# Altium schematic sheet ESP32-Cam.SchDoc
size A; SheetNumber: 1; SheetTotal: 2
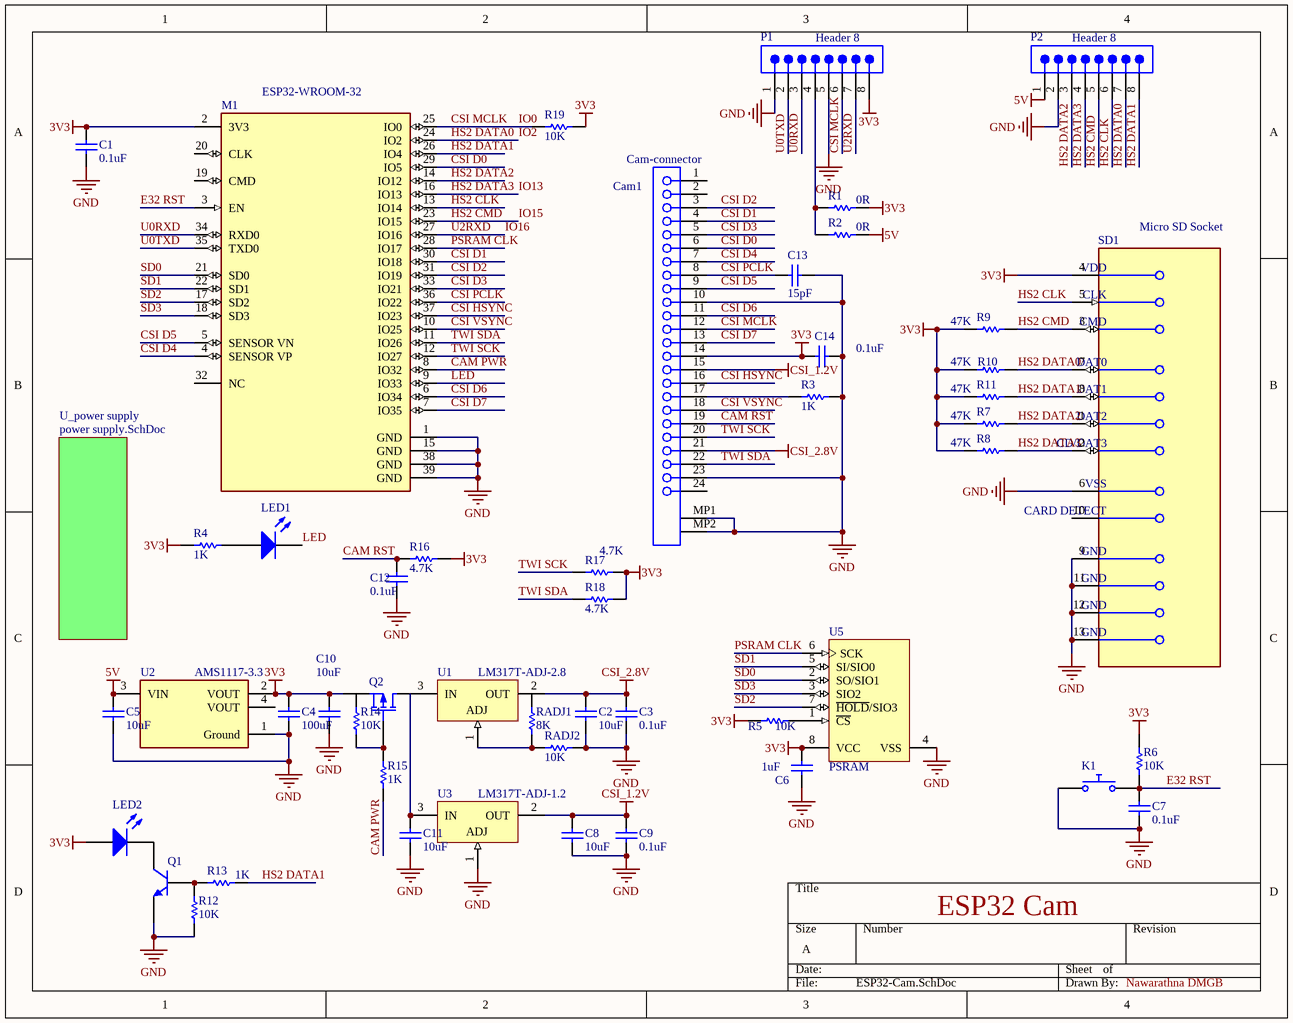
[diagram p0: ESP32-Cam.SchDoc]

## Parts
C1  value 0.1uF  (hidden comment: Capacitor)
C2  value 10uF  (hidden comment: Capacitor)
C3  value 0.1uF  (hidden comment: Capacitor)
C4  value 100uF  (hidden comment: Capacitor)
C5  value 10uF  (hidden comment: Capacitor)
C6  value 1uF  (hidden comment: Capacitor)
C7  value 0.1uF  (hidden comment: Capacitor)
C8  value 10uF  (hidden comment: Capacitor)
C9  value 0.1uF  (hidden comment: Capacitor)
C10  value 10uF  (hidden comment: Capacitor)
C11  value 10uF  (hidden comment: Capacitor)
C12  value 0.1uF  (hidden comment: Capacitor)
C13  value 15pF  (hidden comment: Capacitor)
C14  value 0.1uF  (hidden comment: Capacitor)
Cam1  Cam-connector  [MOLX-52435-2471]
K1  Push Button Normally Opened  (value not drawn)
LED1  Light-Emitting Diode  (value not drawn)
LED2  Light-Emitting Diode  (value not drawn)
M1  ESP32-WROOM-32  [FP-ESP32-WROOM-32-MFG]
P1  Header 8  [66200811122]
P2  Header 8  [66200811122]
Q1  Bipolar NPN 3 Pins Transistor Gummel-Poon Model  (value not drawn)
Q2  P-channel Power MOSFET VDMOS Model  (value not drawn)
R1  value 0R  (hidden comment: Resistor)
R2  value 0R  (hidden comment: Resistor)
R3  value 1K  (hidden comment: Resistor)
R4  value 1K  (hidden comment: Resistor)
R5  value 10K  (hidden comment: Resistor)
R6  value 10K  (hidden comment: Resistor)
R7  value 47K  (hidden comment: Resistor)
R8  value 47K  (hidden comment: Resistor)
R9  value 47K  (hidden comment: Resistor)
R10  value 47K  (hidden comment: Resistor)
R11  value 47K  (hidden comment: Resistor)
R12  value 10K  (hidden comment: Resistor)
R13  value 1K  (hidden comment: Resistor)
R14  value 10K  (hidden comment: Resistor)
R15  value 1K  (hidden comment: Resistor)
R16  value 4.7K  (hidden comment: Resistor)
R17  value 4.7K  (hidden comment: Resistor)
R18  value 4.7K  (hidden comment: Resistor)
R19  value 10K  (hidden comment: Resistor)
RADJ1  value 8K  (hidden comment: Resistor)
RADJ2  value 10K  (hidden comment: Resistor)
SD1  Micro SD Socket  [FP-DM3CS-SF-MFG]
U1  LM317T-ADJ-2.8  [TO-220]
U2  AMS1117-3.3  [FP-AMS1117-IPC_C]
U3  LM317T-ADJ-1.2  [TO-220]
U5  PSRAM  [MCHP-SOIC-SN8_N]

## Sub-sheets
U_power supply = power supply.SchDoc: no entries

## Nets
3V3: C1.1 C4.1 C6.1 C10.1 C14.1 Cam1.14 LED2.1(A) M1.2(3V3) P1.8 Q2.3(S) R1.1 R4.1 R5.1 R6.1 R7.1 R8.1 R9.1 R10.1 R11.1 R16.2 R17.2 R18.2 R19.2 SD1.4(VDD) U2.2(VOUT) U5.8(VCC)
5V: C5.1 P2.1 R2.1 U2.3(VIN)
CSI_1.2V: C8.1 C9.1 Cam1.15 U3.2(OUT)
CSI_2.8V: C2.1 C3.1 Cam1.21 U1.2(OUT)
GND: C1.2 C2.2 C3.2 C4.2 C5.2 C6.2 C7.2 C8.2 C9.2 C10.2 C11.2 C12.2 C13.2 C14.2 Cam1.10 Cam1.23 Cam1.MP1 Cam1.MP2 K1.1 M1.1(GND) M1.15(GND) M1.38(GND) M1.39(GND) P1.1 P1.5 P2.2 Q1.3(E) R3.2 R12.2 RADJ2.2 SD1.6(VSS) SD1.9(GND) SD1.11(GND) SD1.12(GND) SD1.13(GND) U2.1(Ground) U3.1(ADJ) U5.4(VSS)
CAM PWR: M1.8(IO32) R15.2
CAM RST: C12.1 Cam1.19 R16.1
CSI D0: Cam1.6 M1.29(IO5)
CSI D1: Cam1.4 M1.30(IO18)
CSI D2: Cam1.3 M1.31(IO19)
CSI D3: Cam1.5 M1.33(IO21)
CSI D4: Cam1.7 M1.4(SENSOR_VP)
CSI D5: Cam1.9 M1.5(SENSOR_VN)
CSI D6: Cam1.11 M1.6(IO34)
CSI D7: Cam1.13 M1.7(IO35)
CSI HSYNC: Cam1.16 M1.37(IO23)
CSI MCLK: Cam1.12 M1.25(IO0) P1.6 R19.1  [also labelled IO0]
CSI PCLK: C13.1 Cam1.8 M1.36(IO22)
CSI VSYNC: Cam1.18 M1.10(IO25)
E32 RST: C7.1 K1.2 M1.3(EN) R6.2
HS2 CLK: M1.13(IO14) P2.6 SD1.5(CLK)
HS2 CMD: M1.23(IO15) P2.5 R9.2 SD1.3(CMD)  [also labelled IO15]
HS2 DATA0: M1.24(IO2) P2.7 R10.2 SD1.7(DAT0)  [also labelled IO2]
HS2 DATA1: M1.26(IO4) P2.8 R11.2 R13.1 SD1.8(DAT1)
HS2 DATA2: M1.14(IO12) P2.3 R7.2 SD1.1(DAT2)
HS2 DATA3: M1.16(IO13) P2.4 R8.2 SD1.2(CD/DAT3)  [also labelled IO13]
IO16: M1.27(IO16) P1.7  [also labelled U2RXD]
LED: LED1.2(K) M1.9(IO33)
PSRAM CLK: M1.28(IO17) U5.6(SCK)
SD0: M1.21(SD0) U5.2(SO/SIO1)
SD1: M1.22(SD1) U5.5(SI/SIO0)
SD2: M1.17(SD2) U5.7(~{HOLD}/SIO3)
SD3: M1.18(SD3) U5.3(SIO2)
TWI SCK: Cam1.20 M1.12(IO27) R17.1
TWI SDA: Cam1.22 M1.11(IO26) R18.1
U0RXD: M1.34(RXD0) P1.3
U0TXD: M1.35(TXD0) P1.2
NetC11_1: C11.1 U1.3(IN) U3.3(IN)
NetCam1_17: Cam1.17 R3.1
NetLED1_1: LED1.1(A) R4.2
NetLED2_2: LED2.2(K) Q1.1(C)
NetP1_4: P1.4 R1.2 R2.2
NetQ1_2: Q1.2(B) R12.1 R13.2
NetQ2_2: Q2.2(G) R14.2 R15.1
NetR5_2: R5.2 U5.1(~{CS})
NetRADJ1_2: RADJ1.2 RADJ2.1 U1.1(ADJ)

Not connected (* = marked no-connect by the designer): Cam1 1 2 24; M1 19(CMD) 20(CLK) 32(NC); Q2 1(D); R14 1; RADJ1 1; SD1 10(CARD_DETECT); U2 4(VOUT)

## Notes on the sheet
- ESP32 Cam
- Nawarathna DMGB

## Library data of the parts
C1-C14 = Capacitor: SimulationGenericComponent: True
Cam1 = CMP-1241-00275-1: 0.5 mm Pitch Easy-On(TM) Type FPC Connector, 2.0 mm Mated Height, Right Angle, ZIF, SMT, Top Contact, 24 Circuits, -40 to 85 degC, ELV and RoHS Compliant, Tape and Reel; PartNumber: 52435-2471; Manufacturer: Molex; Pitch - Mating Interface: 0.50mm; PCB Locator: No; Current (Max per Contact): 0.5A; PCB Retention: Yes; Circuits (Loaded): 24; Material - Metal: Phosphor Bronze; Material - Plating Termination: Gold; Mated Height: 2.00mm; Entry Angle: 90degrees Angle; Durability (mating cycles max): 20; Voltage (Max): 50V AC (RMS)/DC; ComponentLink1Description: Manufacturer URL; Polarized to PCB: Yes; Contact Position: Top; RoHS: TRUE; ComponentLink3Description: Package Specification; Mounting Technology: Surface Mount; ComponentLink2URL: http://www.molex.com/webdocs/datasheets/pdf/en-us/0524352471_FFC_FPC_CONNECTORS.pdf; PackageDescription: 24-Lead FPC Connector, Pitch 0.5 mm; Packing: Tape and Reel; ComponentLink1URL: http://www.molex.com/molex/index.jsp; PackageVersion: Rev. D, 07/2010; ComponentLink3URL: http://www.molex.com/pdm_docs/sd/524352471_sd.pdf; Stackable: No; PackageReference: 52435-2471; Number of Rows: 1; ComponentLink2Description: Datasheet; Orientation: Right Angle; Material - Plating Mating: Gold
K1 = Push Button NO: closed: 0; Rclosed: 1m; Ropen: 1Meg; SimulationGenericComponent: True
LED1 LED2 = LED: AF: 1; BV: 0; BV_MAX: 1e99; EG: 1.11; FC: 0.5; IBV: 0.001; IS: 1e-14; MJSW: 0.33; NTUN: 30; TNOM: 27; XTI: 3; SimulationGenericComponent: True; CJO: 0; CJP: 0; CTA: 0; CTP: 0; FCS: 0.5; FV_MAX: 1e99; IKF: 0; IKR: 0; ISR: 1e-14; JSW: 0; JTUN: 0; JTUNSW: 0; KEG: 1; KF: 0; LEVEL: 1; N: 1; NBV: 1; NR: 1; NS: 1; PHP: 1; RS: 0; TCV: 0; TLEV: 0; TLEVC: 0; TM1: 0; TM2: 0; TPB: 0; TPHP: 0; TRS: 0; TRS2: 0; TT: 0; TTT1: 0; TTT2: 0; VJ: 1; XTITUN: 3
M1 = CMP-194065-000008-1: RX TXRX MOD WIFI SURFACE MOUNT; Frequency: 2.5GHz; Sensitivity: -98dBm; Operating Supply Voltage: 3.6V; Data Rate: 150Mbps; Weight: 0.088185oz; Package Quantity: 550; Min Operating Temperature: -40°C; Mount: Surface Mount; Max Operating Temperature: 85°C; Packaging: Cut Tape; Case/Package: SMD/SMT
P1 P2 = CMP-1502-00446-2: NexarPartId: 23024701; Pitch: 3mm; Number of Contacts: 8; Insulation Resistance: 1GΩ; Connector Type: Male Pin, Socket; Contact Resistance: 10mΩ; Gender: Male; Current Rating: 5A; Operating Supply Voltage: 250V; Height: 11mm; Max Operating Temperature: 105°C; Mount: Through Hole; Orientation: Vertical; Fastening Type: Ramp; Number of Positions: 8; Lead Pitch: 3mm; Number of Rows: 1; RoHS: Compliant; Termination: Kinked Pin; Width: 27.65mm; Contact Material: Copper; REACH SVHC: Unknown; Contact Plating: Tin; Length: 27.65mm; Color: Black; Min Operating Temperature: -40°C; Number of Pins: 8
Q1 = BJT NPN_GP: SimulationGenericComponent: True; BF: 100; AF: 0; BR: 1; EG: 1.11; FC: 0.5; IS: 1e-16; MJC: 0.33; NC: 2; NE: 1.5; TNOM: 27; VBC_MAX: 1e99; VJC: 0.75; XTI: 3; CJC: 0; CJE: 0; CJS: 0; CTC: 0; CTE: 0; CTS: 0; IKF: 0; IKR: 0; IRB: 0; ISC: 0; ISE: 0; ISS: 0; ITF: 0; KF: 0; MJE: 0.33; MJS: 0; NF: 1; NKF: 0.5; NR: 1; NS: 1; PTF: 0; RB: 0; RBM: 0; RC: 0; RE: 0; SUBS: 1; TBF1: 0; TBF2: 0; TBR1: 0; TBR2: 0; TF: 0; TIKF1: 0; TIKF2: 0; TIKR1: 0; TIKR2: 0; TIRB1: 0; TIRB2: 0; TIS1: 0; TIS2: 0; TISC1: 0; TISC2: 0; TISE1: 0; TISE2: 0; TITF1: 0; TITF2: 0; TLEV: 0; TLEVC: 0; TMJC1: 0; TMJC2: 0; TMJE1: 0; TMJE2: 0; TMJS1: 0; TMJS2: 0; TNC1: 0; TNC2: 0; TNE1: 0; TNE2: 0; TNF1: 0; TNF2: 0; TNR1: 0; TNR2: 0; TNS1: 0; TNS2: 0; TR: 0; TRB1: 0; TRB2: 0; TRC1: 0; TRC2: 0; TRE1: 0; TRE2: 0; TRM1: 0; TRM2: 0; TTF1: 0; TTF2: 0; TTR1: 0; TTR2: 0; TVAF1: 0; TVAF2: 0; TVAR1: 0; TVAR2: 0; TVJC: 0; TVJE: 0; TVJS: 0; VAF: 0; VAR: 0; VBE_MAX: 1e99; VCE_MAX: 1e99; VJE: 0.75; VJS: 0.75; VTF: 0; XCJC: 1; XTB: 0; XTF: 0
Q2 = MOSFET P-ch VDMOS: XTI: 0; A: 1; BV: 1e30; EG: 1.11; FC: 0.5; IBV: 1e-10; IS: 1e-14; PHI: 0.6; TNOM: 27; VJ: 0.8; SimulationGenericComponent: True; CGDMAX: 0; CGDMIN: 0; CGS: 0; CJO: 0; KP: 1; KSUBTHRES: 0; LAMBDA: 0; M: 0.5; MTRIODE: 1; N: 1; NBV: 1; NCHAN: 1; PCHAN: 1; RB: 0; RD: 0; RDS: 1e30; RG: 0; RQ: 0; RS: 0; SUBSHIFT: 0; SUBSLOPE: 0; THETA: 0; TT: 0; VQ: 0; VTO: 0
R1-R19 RADJ1 RADJ2 = Resistor: TC1: 0; SimulationGenericComponent: True; TC2: 0
SD1 = CMP-11597-000003-1: CONN MICRO SD CARD HINGED TYPE; Pitch: 1.1mm; Connector Type: Connector; Current Rating: 500mA; Voltage Rating (AC): 125V; Gender: Female; Insulation Resistance: 1GR; Number of Positions: 8; Contact Resistance: 100mR; Packaging: Tape and Reel; Flammability Rating: UL94 V-0; Lead Free: Lead Free; Min Operating Temperature: -25°C; Orientation: Right Angle; Width: 13.8mm; Number of Rows: 1; Housing Material: Polymer; Package Quantity: 1; Mount: Surface Mount; Max Current Rating: 500mA; Radiation Hardening: No; Max Operating Temperature: 85°C; Contact Plating: Gold; Depth: 1.83mm; Contact Material: Gold; Length: 14.1mm; Number of Contacts: 8; Termination: Solder
U1 U3 = CMP-0244-00444-1: 1.5A, 1.2V to 37V Adjustable Voltage Regulator, 3-Pin TO-220; PackageVersion: 2011; ComponentLink1URL: http://www.st.com; ComponentLink2URL: http://www.st.com/internet/com/TECHNICAL_RESOURCES/TECHNICAL_LITERATURE/DATASHEET/CD00000455.pdf; PackageDescription: TO, Thru-Hole, Vertical, Heatsink Mounted; 3 In-Line Leads; Pitch 2.54 mm; PackageReference: TO-220; ComponentLink1Description: Manufacturer URL; ComponentLink3URL: http://www.st.com/internet/com/TECHNICAL_RESOURCES/TECHNICAL_LITERATURE/PACKAGE_INFORMATION/CD00004649.pdf; DatasheetVersion: 1/11/2011; ComponentLink2Description: Datasheet; ComponentLink3Description: Package Specification
U2 = CMP-209535-000001-1: LDO Voltage Regulators 1A, 3.3V; Manufacturer: Advanced Monolithic Systems; Dropout Voltage: 1.1V; Output Type: Fixed; Nominal Supply Current: 5mA; Max Power Dissipation: 1.2W; Max Supply Voltage: 15V; Number Of Outputs: 1; Standoff Height: 0.64mm; Max Junction Temp: +125°C; Height: 1.8mm; Package: AMS1117; Device Class L2: Power Management ICs; ComponentLink2Description: Datasheet; ComponentLink2URL: http://www.advanced-monolithic.com/pdf/ds1117.pdf; Category: IC; RoHS: TRUE; Automotive: No; Device Class L1: Integrated Circuits (ICs); Output Current: 1A; Device Class L3: Voltage Regulators - Linear; Temperature: -40°C to +125°C; Output Voltage: 3.3V; Manufacturer Part Number: AMS1117-3.3; Temperature Range Low: -40°C; Octopart: https://octopart.com/ams1117-3.3-advanced+monolithic+systems-25899300; Lead Free: Yes; Ipc Land Pattern Name: SOT229P700X180-4; Temperature Range High: +125°C
U5 = CMP-0163-00041-1: 512K bits SPI Serial SRAM with SDI and SQI Interface, 2.5 to 5.5 V, 20 MHz, -40 to 85 degC, 8-pin SOIC (SN8), Tube; Manufacturer: Microchip; PartNumber: 23LC512-I/SN; ComponentLink1Description: Manufacturer URL; DatasheetVersion: Rev. A; ComponentLink3Description: Package Specification; ComponentLink2URL: http://ww1.microchip.com/downloads/en/DeviceDoc/25155A.pdf; ComponentLink4Description: Product URL; ComponentLink4URL: http://www.microchip.com/23LC512; PackageReference: SOIC-SN8; PackageVersion: C04-057C; ComponentLink1URL: http://www.microchip.com; ComponentLink2Description: Datasheet; PackageDescription: 8-Lead Plastic Small Outline, 4.9 x 3.9 mm Body, 1.27 mm Pitch; ComponentLink3URL: http://www.microchip.com/stellent/groups/techpub_sg/documents/packagingspec/en012702.pdf; Mounting Technology: Surface Mount